# Altium project Control_Logic.PrjPcb (part 2 of 3)

## Sheet PLEN_Control_Logic_pt3.SchDoc
size 594 x 420 mm; Author: ALTIUM GOSTBOM2.0 KEV
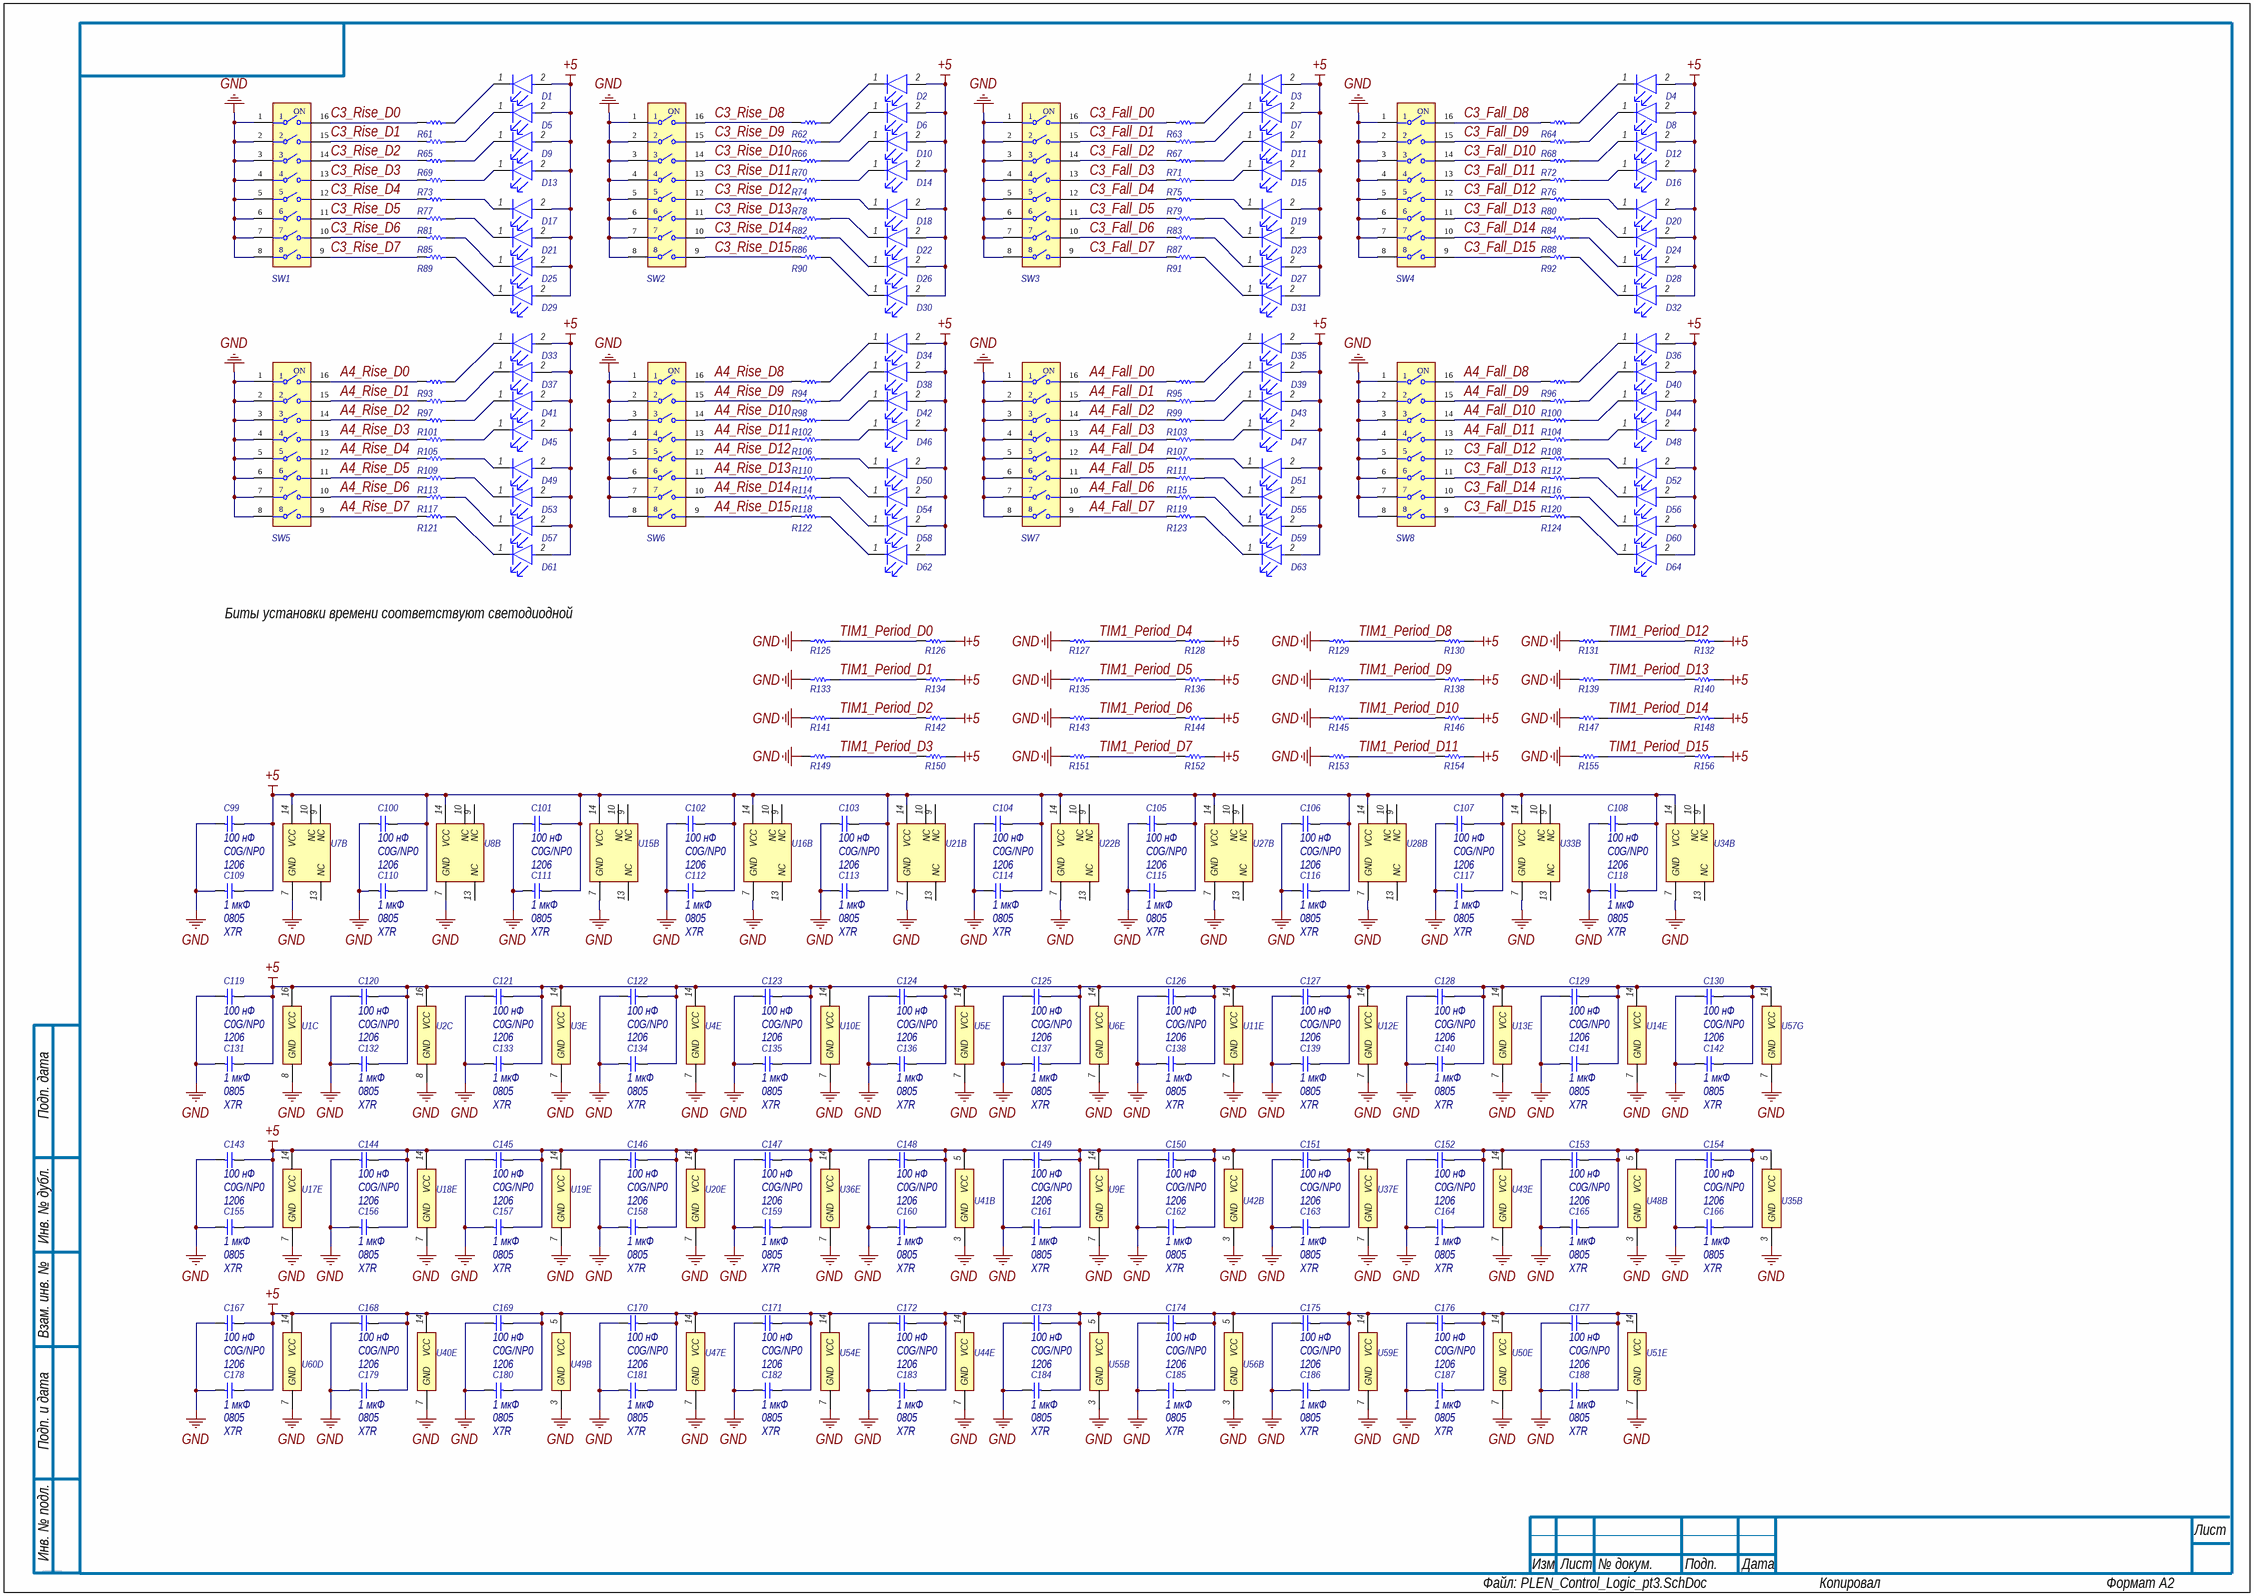
[diagram p5: PLEN_Control_Logic_pt3.SchDoc]

### Parts
(Parts that share a designator on the sheet are numbered #1, #2 ... from top to bottom, then left to right.)
C99  value 100 нФ  Dielectric Characteristic: C0G/NP0  Package Reference: 1206  [CAPC3216X180X55NL20T25]  (hidden comment: GRM31C5C1E104JA01L)
C100  value 100 нФ  Dielectric Characteristic: C0G/NP0  Package Reference: 1206  [CAPC3216X180X55NL20T25]  (hidden comment: GRM31C5C1E104JA01L)
C101#1  value 100 нФ  Dielectric Characteristic: C0G/NP0  Package Reference: 1206  [CAPC3216X180X55NL20T25]  (hidden comment: GRM31C5C1E104JA01L)
C102  value 100 нФ  Dielectric Characteristic: C0G/NP0  Package Reference: 1206  [CAPC3216X180X55NL20T25]  (hidden comment: GRM31C5C1E104JA01L)
C103  value 100 нФ  Dielectric Characteristic: C0G/NP0  Package Reference: 1206  [CAPC3216X180X55NL20T25]  (hidden comment: GRM31C5C1E104JA01L)
C104  value 100 нФ  Dielectric Characteristic: C0G/NP0  Package Reference: 1206  [CAPC3216X180X55NL20T25]  (hidden comment: GRM31C5C1E104JA01L)
C105  value 100 нФ  Dielectric Characteristic: C0G/NP0  Package Reference: 1206  [CAPC3216X180X55NL20T25]  (hidden comment: GRM31C5C1E104JA01L)
C106  value 100 нФ  Dielectric Characteristic: C0G/NP0  Package Reference: 1206  [CAPC3216X180X55NL20T25]  (hidden comment: GRM31C5C1E104JA01L)
C107  value 100 нФ  Dielectric Characteristic: C0G/NP0  Package Reference: 1206  [CAPC3216X180X55NL20T25]  (hidden comment: GRM31C5C1E104JA01L)
C108  value 100 нФ  Dielectric Characteristic: C0G/NP0  Package Reference: 1206  [CAPC3216X180X55NL20T25]  (hidden comment: GRM31C5C1E104JA01L)
C109  value 1 мкФ  Case: 0805  Dielectric: X7R  [CAPC2013X140X50LL20T25]  (hidden comment: C0805C105K3RACTU)
C110  value 1 мкФ  Case: 0805  Dielectric: X7R  [CAPC2013X140X50LL20T25]  (hidden comment: C0805C105K3RACTU)
C111#1  value 1 мкФ  Case: 0805  Dielectric: X7R  [CAPC2013X140X50LL20T25]  (hidden comment: C0805C105K3RACTU)
C112  value 1 мкФ  Case: 0805  Dielectric: X7R  [CAPC2013X140X50LL20T25]  (hidden comment: C0805C105K3RACTU)
C113  value 1 мкФ  Case: 0805  Dielectric: X7R  [CAPC2013X140X50LL20T25]  (hidden comment: C0805C105K3RACTU)
C114  value 1 мкФ  Case: 0805  Dielectric: X7R  [CAPC2013X140X50LL20T25]  (hidden comment: C0805C105K3RACTU)
C115  value 1 мкФ  Case: 0805  Dielectric: X7R  [CAPC2013X140X50LL20T25]  (hidden comment: C0805C105K3RACTU)
C116  value 1 мкФ  Case: 0805  Dielectric: X7R  [CAPC2013X140X50LL20T25]  (hidden comment: C0805C105K3RACTU)
C117  value 1 мкФ  Case: 0805  Dielectric: X7R  [CAPC2013X140X50LL20T25]  (hidden comment: C0805C105K3RACTU)
C118  value 1 мкФ  Case: 0805  Dielectric: X7R  [CAPC2013X140X50LL20T25]  (hidden comment: C0805C105K3RACTU)
C119  value 100 нФ  Dielectric Characteristic: C0G/NP0  Package Reference: 1206  [CAPC3216X180X55NL20T25]  (hidden comment: GRM31C5C1E104JA01L)
C120  value 100 нФ  Dielectric Characteristic: C0G/NP0  Package Reference: 1206  [CAPC3216X180X55NL20T25]  (hidden comment: GRM31C5C1E104JA01L)
C121  value 100 нФ  Dielectric Characteristic: C0G/NP0  Package Reference: 1206  [CAPC3216X180X55NL20T25]  (hidden comment: GRM31C5C1E104JA01L)
C122  value 100 нФ  Dielectric Characteristic: C0G/NP0  Package Reference: 1206  [CAPC3216X180X55NL20T25]  (hidden comment: GRM31C5C1E104JA01L)
C123  value 100 нФ  Dielectric Characteristic: C0G/NP0  Package Reference: 1206  [CAPC3216X180X55NL20T25]  (hidden comment: GRM31C5C1E104JA01L)
C124  value 100 нФ  Dielectric Characteristic: C0G/NP0  Package Reference: 1206  [CAPC3216X180X55NL20T25]  (hidden comment: GRM31C5C1E104JA01L)
C125  value 100 нФ  Dielectric Characteristic: C0G/NP0  Package Reference: 1206  [CAPC3216X180X55NL20T25]  (hidden comment: GRM31C5C1E104JA01L)
C126  value 100 нФ  Dielectric Characteristic: C0G/NP0  Package Reference: 1206  [CAPC3216X180X55NL20T25]  (hidden comment: GRM31C5C1E104JA01L)
C127  value 100 нФ  Dielectric Characteristic: C0G/NP0  Package Reference: 1206  [CAPC3216X180X55NL20T25]  (hidden comment: GRM31C5C1E104JA01L)
C128  value 100 нФ  Dielectric Characteristic: C0G/NP0  Package Reference: 1206  [CAPC3216X180X55NL20T25]  (hidden comment: GRM31C5C1E104JA01L)
C129  value 100 нФ  Dielectric Characteristic: C0G/NP0  Package Reference: 1206  [CAPC3216X180X55NL20T25]  (hidden comment: GRM31C5C1E104JA01L)
C130  value 100 нФ  Dielectric Characteristic: C0G/NP0  Package Reference: 1206  [CAPC3216X180X55NL20T25]  (hidden comment: GRM31C5C1E104JA01L)
C131  value 1 мкФ  Case: 0805  Dielectric: X7R  [CAPC2013X140X50LL20T25]  (hidden comment: C0805C105K3RACTU)
C132  value 1 мкФ  Case: 0805  Dielectric: X7R  [CAPC2013X140X50LL20T25]  (hidden comment: C0805C105K3RACTU)
C133  value 1 мкФ  Case: 0805  Dielectric: X7R  [CAPC2013X140X50LL20T25]  (hidden comment: C0805C105K3RACTU)
C134  value 1 мкФ  Case: 0805  Dielectric: X7R  [CAPC2013X140X50LL20T25]  (hidden comment: C0805C105K3RACTU)
C135  value 1 мкФ  Case: 0805  Dielectric: X7R  [CAPC2013X140X50LL20T25]  (hidden comment: C0805C105K3RACTU)
C136  value 1 мкФ  Case: 0805  Dielectric: X7R  [CAPC2013X140X50LL20T25]  (hidden comment: C0805C105K3RACTU)
C137  value 1 мкФ  Case: 0805  Dielectric: X7R  [CAPC2013X140X50LL20T25]  (hidden comment: C0805C105K3RACTU)
C138  value 1 мкФ  Case: 0805  Dielectric: X7R  [CAPC2013X140X50LL20T25]  (hidden comment: C0805C105K3RACTU)
C139  value 1 мкФ  Case: 0805  Dielectric: X7R  [CAPC2013X140X50LL20T25]  (hidden comment: C0805C105K3RACTU)
C140  value 1 мкФ  Case: 0805  Dielectric: X7R  [CAPC2013X140X50LL20T25]  (hidden comment: C0805C105K3RACTU)
C141  value 1 мкФ  Case: 0805  Dielectric: X7R  [CAPC2013X140X50LL20T25]  (hidden comment: C0805C105K3RACTU)
C142  value 1 мкФ  Case: 0805  Dielectric: X7R  [CAPC2013X140X50LL20T25]  (hidden comment: C0805C105K3RACTU)
C143  value 100 нФ  Dielectric Characteristic: C0G/NP0  Package Reference: 1206  [CAPC3216X180X55NL20T25]  (hidden comment: GRM31C5C1E104JA01L)
C144  value 100 нФ  Dielectric Characteristic: C0G/NP0  Package Reference: 1206  [CAPC3216X180X55NL20T25]  (hidden comment: GRM31C5C1E104JA01L)
C145  value 100 нФ  Dielectric Characteristic: C0G/NP0  Package Reference: 1206  [CAPC3216X180X55NL20T25]  (hidden comment: GRM31C5C1E104JA01L)
C146  value 100 нФ  Dielectric Characteristic: C0G/NP0  Package Reference: 1206  [CAPC3216X180X55NL20T25]  (hidden comment: GRM31C5C1E104JA01L)
C147  value 100 нФ  Dielectric Characteristic: C0G/NP0  Package Reference: 1206  [CAPC3216X180X55NL20T25]  (hidden comment: GRM31C5C1E104JA01L)
C148  value 100 нФ  Dielectric Characteristic: C0G/NP0  Package Reference: 1206  [CAPC3216X180X55NL20T25]  (hidden comment: GRM31C5C1E104JA01L)
C149  value 100 нФ  Dielectric Characteristic: C0G/NP0  Package Reference: 1206  [CAPC3216X180X55NL20T25]  (hidden comment: GRM31C5C1E104JA01L)
C150  value 100 нФ  Dielectric Characteristic: C0G/NP0  Package Reference: 1206  [CAPC3216X180X55NL20T25]  (hidden comment: GRM31C5C1E104JA01L)
C151  value 100 нФ  Dielectric Characteristic: C0G/NP0  Package Reference: 1206  [CAPC3216X180X55NL20T25]  (hidden comment: GRM31C5C1E104JA01L)
C152  value 100 нФ  Dielectric Characteristic: C0G/NP0  Package Reference: 1206  [CAPC3216X180X55NL20T25]  (hidden comment: GRM31C5C1E104JA01L)
C153  value 100 нФ  Dielectric Characteristic: C0G/NP0  Package Reference: 1206  [CAPC3216X180X55NL20T25]  (hidden comment: GRM31C5C1E104JA01L)
C154  value 100 нФ  Dielectric Characteristic: C0G/NP0  Package Reference: 1206  [CAPC3216X180X55NL20T25]  (hidden comment: GRM31C5C1E104JA01L)
C155  value 1 мкФ  Case: 0805  Dielectric: X7R  [CAPC2013X140X50LL20T25]  (hidden comment: C0805C105K3RACTU)
C156  value 1 мкФ  Case: 0805  Dielectric: X7R  [CAPC2013X140X50LL20T25]  (hidden comment: C0805C105K3RACTU)
C157  value 1 мкФ  Case: 0805  Dielectric: X7R  [CAPC2013X140X50LL20T25]  (hidden comment: C0805C105K3RACTU)
C158  value 1 мкФ  Case: 0805  Dielectric: X7R  [CAPC2013X140X50LL20T25]  (hidden comment: C0805C105K3RACTU)
C159  value 1 мкФ  Case: 0805  Dielectric: X7R  [CAPC2013X140X50LL20T25]  (hidden comment: C0805C105K3RACTU)
C160  value 1 мкФ  Case: 0805  Dielectric: X7R  [CAPC2013X140X50LL20T25]  (hidden comment: C0805C105K3RACTU)
C161  value 1 мкФ  Case: 0805  Dielectric: X7R  [CAPC2013X140X50LL20T25]  (hidden comment: C0805C105K3RACTU)
C162  value 1 мкФ  Case: 0805  Dielectric: X7R  [CAPC2013X140X50LL20T25]  (hidden comment: C0805C105K3RACTU)
C163  value 1 мкФ  Case: 0805  Dielectric: X7R  [CAPC2013X140X50LL20T25]  (hidden comment: C0805C105K3RACTU)
C164  value 1 мкФ  Case: 0805  Dielectric: X7R  [CAPC2013X140X50LL20T25]  (hidden comment: C0805C105K3RACTU)
C165  value 1 мкФ  Case: 0805  Dielectric: X7R  [CAPC2013X140X50LL20T25]  (hidden comment: C0805C105K3RACTU)
C166  value 1 мкФ  Case: 0805  Dielectric: X7R  [CAPC2013X140X50LL20T25]  (hidden comment: C0805C105K3RACTU)
C167  value 100 нФ  Dielectric Characteristic: C0G/NP0  Package Reference: 1206  [CAPC3216X180X55NL20T25]  (hidden comment: GRM31C5C1E104JA01L)
C168  value 100 нФ  Dielectric Characteristic: C0G/NP0  Package Reference: 1206  [CAPC3216X180X55NL20T25]  (hidden comment: GRM31C5C1E104JA01L)
C169  value 100 нФ  Dielectric Characteristic: C0G/NP0  Package Reference: 1206  [CAPC3216X180X55NL20T25]  (hidden comment: GRM31C5C1E104JA01L)
C170  value 100 нФ  Dielectric Characteristic: C0G/NP0  Package Reference: 1206  [CAPC3216X180X55NL20T25]  (hidden comment: GRM31C5C1E104JA01L)
C171  value 100 нФ  Dielectric Characteristic: C0G/NP0  Package Reference: 1206  [CAPC3216X180X55NL20T25]  (hidden comment: GRM31C5C1E104JA01L)
C172  value 100 нФ  Dielectric Characteristic: C0G/NP0  Package Reference: 1206  [CAPC3216X180X55NL20T25]  (hidden comment: GRM31C5C1E104JA01L)
C173  value 100 нФ  Dielectric Characteristic: C0G/NP0  Package Reference: 1206  [CAPC3216X180X55NL20T25]  (hidden comment: GRM31C5C1E104JA01L)
C174  value 100 нФ  Dielectric Characteristic: C0G/NP0  Package Reference: 1206  [CAPC3216X180X55NL20T25]  (hidden comment: GRM31C5C1E104JA01L)
C175  value 100 нФ  Dielectric Characteristic: C0G/NP0  Package Reference: 1206  [CAPC3216X180X55NL20T25]  (hidden comment: GRM31C5C1E104JA01L)
C176  value 100 нФ  Dielectric Characteristic: C0G/NP0  Package Reference: 1206  [CAPC3216X180X55NL20T25]  (hidden comment: GRM31C5C1E104JA01L)
C177  value 100 нФ  Dielectric Characteristic: C0G/NP0  Package Reference: 1206  [CAPC3216X180X55NL20T25]  (hidden comment: GRM31C5C1E104JA01L)
C178  value 1 мкФ  Case: 0805  Dielectric: X7R  [CAPC2013X140X50LL20T25]  (hidden comment: C0805C105K3RACTU)
C179  value 1 мкФ  Case: 0805  Dielectric: X7R  [CAPC2013X140X50LL20T25]  (hidden comment: C0805C105K3RACTU)
C180  value 1 мкФ  Case: 0805  Dielectric: X7R  [CAPC2013X140X50LL20T25]  (hidden comment: C0805C105K3RACTU)
C181  value 1 мкФ  Case: 0805  Dielectric: X7R  [CAPC2013X140X50LL20T25]  (hidden comment: C0805C105K3RACTU)
C182  value 1 мкФ  Case: 0805  Dielectric: X7R  [CAPC2013X140X50LL20T25]  (hidden comment: C0805C105K3RACTU)
C183  value 1 мкФ  Case: 0805  Dielectric: X7R  [CAPC2013X140X50LL20T25]  (hidden comment: C0805C105K3RACTU)
C184  value 1 мкФ  Case: 0805  Dielectric: X7R  [CAPC2013X140X50LL20T25]  (hidden comment: C0805C105K3RACTU)
C185  value 1 мкФ  Case: 0805  Dielectric: X7R  [CAPC2013X140X50LL20T25]  (hidden comment: C0805C105K3RACTU)
C186  value 1 мкФ  Case: 0805  Dielectric: X7R  [CAPC2013X140X50LL20T25]  (hidden comment: C0805C105K3RACTU)
C187  value 1 мкФ  Case: 0805  Dielectric: X7R  [CAPC2013X140X50LL20T25]  (hidden comment: C0805C105K3RACTU)
C188  value 1 мкФ  Case: 0805  Dielectric: X7R  [CAPC2013X140X50LL20T25]  (hidden comment: C0805C105K3RACTU)
D1  APTD3216CGCK  [FP-APTD3216CGCK-MFG]  (value not drawn)
D2  APTD3216CGCK  [FP-APTD3216CGCK-MFG]  (value not drawn)
D3  APTD3216CGCK  [FP-APTD3216CGCK-MFG]  (value not drawn)
D4  APTD3216CGCK  [FP-APTD3216CGCK-MFG]  (value not drawn)
D5  APTD3216CGCK  [FP-APTD3216CGCK-MFG]  (value not drawn)
D6  APTD3216CGCK  [FP-APTD3216CGCK-MFG]  (value not drawn)
D7  APTD3216CGCK  [FP-APTD3216CGCK-MFG]  (value not drawn)
D8  APTD3216CGCK  [FP-APTD3216CGCK-MFG]  (value not drawn)
D9  APTD3216CGCK  [FP-APTD3216CGCK-MFG]  (value not drawn)
D10  APTD3216CGCK  [FP-APTD3216CGCK-MFG]  (value not drawn)
D11  APTD3216CGCK  [FP-APTD3216CGCK-MFG]  (value not drawn)
D12  APTD3216CGCK  [FP-APTD3216CGCK-MFG]  (value not drawn)
D13  APTD3216CGCK  [FP-APTD3216CGCK-MFG]  (value not drawn)
D14  APTD3216CGCK  [FP-APTD3216CGCK-MFG]  (value not drawn)
D15  APTD3216CGCK  [FP-APTD3216CGCK-MFG]  (value not drawn)
D16  APTD3216CGCK  [FP-APTD3216CGCK-MFG]  (value not drawn)
D17  APTD3216CGCK  [FP-APTD3216CGCK-MFG]  (value not drawn)
D18  APTD3216CGCK  [FP-APTD3216CGCK-MFG]  (value not drawn)
D19  APTD3216CGCK  [FP-APTD3216CGCK-MFG]  (value not drawn)
D20  APTD3216CGCK  [FP-APTD3216CGCK-MFG]  (value not drawn)
D21  APTD3216CGCK  [FP-APTD3216CGCK-MFG]  (value not drawn)
D22  APTD3216CGCK  [FP-APTD3216CGCK-MFG]  (value not drawn)
D23  APTD3216CGCK  [FP-APTD3216CGCK-MFG]  (value not drawn)
D24  APTD3216CGCK  [FP-APTD3216CGCK-MFG]  (value not drawn)
D25  APTD3216CGCK  [FP-APTD3216CGCK-MFG]  (value not drawn)
D26  APTD3216CGCK  [FP-APTD3216CGCK-MFG]  (value not drawn)
D27  APTD3216CGCK  [FP-APTD3216CGCK-MFG]  (value not drawn)
D28  APTD3216CGCK  [FP-APTD3216CGCK-MFG]  (value not drawn)
D29  APTD3216CGCK  [FP-APTD3216CGCK-MFG]  (value not drawn)
D30  APTD3216CGCK  [FP-APTD3216CGCK-MFG]  (value not drawn)
D31  APTD3216CGCK  [FP-APTD3216CGCK-MFG]  (value not drawn)
D32  APTD3216CGCK  [FP-APTD3216CGCK-MFG]  (value not drawn)
D33  APTD3216CGCK  [FP-APTD3216CGCK-MFG]  (value not drawn)
D34  APTD3216CGCK  [FP-APTD3216CGCK-MFG]  (value not drawn)
D35  APTD3216CGCK  [FP-APTD3216CGCK-MFG]  (value not drawn)
D36  APTD3216CGCK  [FP-APTD3216CGCK-MFG]  (value not drawn)
D37  APTD3216CGCK  [FP-APTD3216CGCK-MFG]  (value not drawn)
D38  APTD3216CGCK  [FP-APTD3216CGCK-MFG]  (value not drawn)
D39  APTD3216CGCK  [FP-APTD3216CGCK-MFG]  (value not drawn)
D40  APTD3216CGCK  [FP-APTD3216CGCK-MFG]  (value not drawn)
D41  APTD3216CGCK  [FP-APTD3216CGCK-MFG]  (value not drawn)
D42  APTD3216CGCK  [FP-APTD3216CGCK-MFG]  (value not drawn)
D43  APTD3216CGCK  [FP-APTD3216CGCK-MFG]  (value not drawn)
D44  APTD3216CGCK  [FP-APTD3216CGCK-MFG]  (value not drawn)
D45  APTD3216CGCK  [FP-APTD3216CGCK-MFG]  (value not drawn)
D46  APTD3216CGCK  [FP-APTD3216CGCK-MFG]  (value not drawn)
D47  APTD3216CGCK  [FP-APTD3216CGCK-MFG]  (value not drawn)
D48  APTD3216CGCK  [FP-APTD3216CGCK-MFG]  (value not drawn)
D49  APTD3216CGCK  [FP-APTD3216CGCK-MFG]  (value not drawn)
D50  APTD3216CGCK  [FP-APTD3216CGCK-MFG]  (value not drawn)
D51  APTD3216CGCK  [FP-APTD3216CGCK-MFG]  (value not drawn)
D52  APTD3216CGCK  [FP-APTD3216CGCK-MFG]  (value not drawn)
D53  APTD3216CGCK  [FP-APTD3216CGCK-MFG]  (value not drawn)
D54  APTD3216CGCK  [FP-APTD3216CGCK-MFG]  (value not drawn)
D55  APTD3216CGCK  [FP-APTD3216CGCK-MFG]  (value not drawn)
D56  APTD3216CGCK  [FP-APTD3216CGCK-MFG]  (value not drawn)
D57  APTD3216CGCK  [FP-APTD3216CGCK-MFG]  (value not drawn)
D58  APTD3216CGCK  [FP-APTD3216CGCK-MFG]  (value not drawn)
D59  APTD3216CGCK  [FP-APTD3216CGCK-MFG]  (value not drawn)
D60  APTD3216CGCK  [FP-APTD3216CGCK-MFG]  (value not drawn)
D61  APTD3216CGCK  [FP-APTD3216CGCK-MFG]  (value not drawn)
D62  APTD3216CGCK  [FP-APTD3216CGCK-MFG]  (value not drawn)
D63  APTD3216CGCK  [FP-APTD3216CGCK-MFG]  (value not drawn)
D64  APTD3216CGCK  [FP-APTD3216CGCK-MFG]  (value not drawn)
R61  ERA6AEB101V  [RESC2013X60X40ML20T25]  (value not drawn)
R62  ERA6AEB101V  [RESC2013X60X40ML20T25]  (value not drawn)
R63  ERA6AEB101V  [RESC2013X60X40ML20T25]  (value not drawn)
R64  ERA6AEB101V  [RESC2013X60X40ML20T25]  (value not drawn)
R65  ERA6AEB101V  [RESC2013X60X40ML20T25]  (value not drawn)
R66  ERA6AEB101V  [RESC2013X60X40ML20T25]  (value not drawn)
R67  ERA6AEB101V  [RESC2013X60X40ML20T25]  (value not drawn)
R68  ERA6AEB101V  [RESC2013X60X40ML20T25]  (value not drawn)
R69  ERA6AEB101V  [RESC2013X60X40ML20T25]  (value not drawn)
R70  ERA6AEB101V  [RESC2013X60X40ML20T25]  (value not drawn)
R71  ERA6AEB101V  [RESC2013X60X40ML20T25]  (value not drawn)
R72  ERA6AEB101V  [RESC2013X60X40ML20T25]  (value not drawn)
R73  ERA6AEB101V  [RESC2013X60X40ML20T25]  (value not drawn)
R74  ERA6AEB101V  [RESC2013X60X40ML20T25]  (value not drawn)
R75  ERA6AEB101V  [RESC2013X60X40ML20T25]  (value not drawn)
R76  ERA6AEB101V  [RESC2013X60X40ML20T25]  (value not drawn)
R77  ERA6AEB101V  [RESC2013X60X40ML20T25]  (value not drawn)
R78  ERA6AEB101V  [RESC2013X60X40ML20T25]  (value not drawn)
R79  ERA6AEB101V  [RESC2013X60X40ML20T25]  (value not drawn)
R80  ERA6AEB101V  [RESC2013X60X40ML20T25]  (value not drawn)
R81  ERA6AEB101V  [RESC2013X60X40ML20T25]  (value not drawn)
R82  ERA6AEB101V  [RESC2013X60X40ML20T25]  (value not drawn)
R83  ERA6AEB101V  [RESC2013X60X40ML20T25]  (value not drawn)
R84  ERA6AEB101V  [RESC2013X60X40ML20T25]  (value not drawn)
R85  ERA6AEB101V  [RESC2013X60X40ML20T25]  (value not drawn)
R86  ERA6AEB101V  [RESC2013X60X40ML20T25]  (value not drawn)
R87  ERA6AEB101V  [RESC2013X60X40ML20T25]  (value not drawn)
R88  ERA6AEB101V  [RESC2013X60X40ML20T25]  (value not drawn)
R89  ERA6AEB101V  [RESC2013X60X40ML20T25]  (value not drawn)
R90  ERA6AEB101V  [RESC2013X60X40ML20T25]  (value not drawn)
R91  ERA6AEB101V  [RESC2013X60X40ML20T25]  (value not drawn)
R92  ERA6AEB101V  [RESC2013X60X40ML20T25]  (value not drawn)
R93  ERA6AEB101V  [RESC2013X60X40ML20T25]  (value not drawn)
R94  ERA6AEB101V  [RESC2013X60X40ML20T25]  (value not drawn)
R95  ERA6AEB101V  [RESC2013X60X40ML20T25]  (value not drawn)
R96  ERA6AEB101V  [RESC2013X60X40ML20T25]  (value not drawn)
R97  ERA6AEB101V  [RESC2013X60X40ML20T25]  (value not drawn)
R98  ERA6AEB101V  [RESC2013X60X40ML20T25]  (value not drawn)
R99  ERA6AEB101V  [RESC2013X60X40ML20T25]  (value not drawn)
R100  ERA6AEB101V  [RESC2013X60X40ML20T25]  (value not drawn)
R101  ERA6AEB101V  [RESC2013X60X40ML20T25]  (value not drawn)
R102  ERA6AEB101V  [RESC2013X60X40ML20T25]  (value not drawn)
R103  ERA6AEB101V  [RESC2013X60X40ML20T25]  (value not drawn)
R104  ERA6AEB101V  [RESC2013X60X40ML20T25]  (value not drawn)
R105  ERA6AEB101V  [RESC2013X60X40ML20T25]  (value not drawn)
R106  ERA6AEB101V  [RESC2013X60X40ML20T25]  (value not drawn)
R107  ERA6AEB101V  [RESC2013X60X40ML20T25]  (value not drawn)
R108  ERA6AEB101V  [RESC2013X60X40ML20T25]  (value not drawn)
R109  ERA6AEB101V  [RESC2013X60X40ML20T25]  (value not drawn)
R110  ERA6AEB101V  [RESC2013X60X40ML20T25]  (value not drawn)
R111  ERA6AEB101V  [RESC2013X60X40ML20T25]  (value not drawn)
R112  ERA6AEB101V  [RESC2013X60X40ML20T25]  (value not drawn)
R113  ERA6AEB101V  [RESC2013X60X40ML20T25]  (value not drawn)
R114  ERA6AEB101V  [RESC2013X60X40ML20T25]  (value not drawn)
R115  ERA6AEB101V  [RESC2013X60X40ML20T25]  (value not drawn)
R116  ERA6AEB101V  [RESC2013X60X40ML20T25]  (value not drawn)
R117  ERA6AEB101V  [RESC2013X60X40ML20T25]  (value not drawn)
R118  ERA6AEB101V  [RESC2013X60X40ML20T25]  (value not drawn)
R119  ERA6AEB101V  [RESC2013X60X40ML20T25]  (value not drawn)
R120  ERA6AEB101V  [RESC2013X60X40ML20T25]  (value not drawn)
R121  ERA6AEB101V  [RESC2013X60X40ML20T25]  (value not drawn)
R122  ERA6AEB101V  [RESC2013X60X40ML20T25]  (value not drawn)
R123  ERA6AEB101V  [RESC2013X60X40ML20T25]  (value not drawn)
R124  ERA6AEB101V  [RESC2013X60X40ML20T25]  (value not drawn)
R125  ERA6AEB101V  [RESC2013X60X40ML20T25]  (value not drawn)
R126  ERA6AEB101V  [RESC2013X60X40ML20T25]  (value not drawn)
R127  ERA6AEB101V  [RESC2013X60X40ML20T25]  (value not drawn)
R128  ERA6AEB101V  [RESC2013X60X40ML20T25]  (value not drawn)
R129  ERA6AEB101V  [RESC2013X60X40ML20T25]  (value not drawn)
R130  ERA6AEB101V  [RESC2013X60X40ML20T25]  (value not drawn)
R131  ERA6AEB101V  [RESC2013X60X40ML20T25]  (value not drawn)
R132  ERA6AEB101V  [RESC2013X60X40ML20T25]  (value not drawn)
R133  ERA6AEB101V  [RESC2013X60X40ML20T25]  (value not drawn)
R134  ERA6AEB101V  [RESC2013X60X40ML20T25]  (value not drawn)
R135  ERA6AEB101V  [RESC2013X60X40ML20T25]  (value not drawn)
R136  ERA6AEB101V  [RESC2013X60X40ML20T25]  (value not drawn)
R137  ERA6AEB101V  [RESC2013X60X40ML20T25]  (value not drawn)
R138  ERA6AEB101V  [RESC2013X60X40ML20T25]  (value not drawn)
R139  ERA6AEB101V  [RESC2013X60X40ML20T25]  (value not drawn)
R140  ERA6AEB101V  [RESC2013X60X40ML20T25]  (value not drawn)
R141  ERA6AEB101V  [RESC2013X60X40ML20T25]  (value not drawn)
R142  ERA6AEB101V  [RESC2013X60X40ML20T25]  (value not drawn)
R143  ERA6AEB101V  [RESC2013X60X40ML20T25]  (value not drawn)
R144  ERA6AEB101V  [RESC2013X60X40ML20T25]  (value not drawn)
R145  ERA6AEB101V  [RESC2013X60X40ML20T25]  (value not drawn)
R146  ERA6AEB101V  [RESC2013X60X40ML20T25]  (value not drawn)
R147  ERA6AEB101V  [RESC2013X60X40ML20T25]  (value not drawn)
R148  ERA6AEB101V  [RESC2013X60X40ML20T25]  (value not drawn)
R149  ERA6AEB101V  [RESC2013X60X40ML20T25]  (value not drawn)
R150  ERA6AEB101V  [RESC2013X60X40ML20T25]  (value not drawn)
R151  ERA6AEB101V  [RESC2013X60X40ML20T25]  (value not drawn)
R152  ERA6AEB101V  [RESC2013X60X40ML20T25]  (value not drawn)
R153  ERA6AEB101V  [RESC2013X60X40ML20T25]  (value not drawn)
R154  ERA6AEB101V  [RESC2013X60X40ML20T25]  (value not drawn)
R155  ERA6AEB101V  [RESC2013X60X40ML20T25]  (value not drawn)
R156  ERA6AEB101V  [RESC2013X60X40ML20T25]  (value not drawn)
SW1  78B08ST  [FP-78B08ST-MFG]  (value not drawn)
SW2  78B08ST  [FP-78B08ST-MFG]  (value not drawn)
SW3  78B08ST  [FP-78B08ST-MFG]  (value not drawn)
SW4  78B08ST  [FP-78B08ST-MFG]  (value not drawn)
SW5  78B08ST  [FP-78B08ST-MFG]  (value not drawn)
SW6  78B08ST  [FP-78B08ST-MFG]  (value not drawn)
SW7  78B08ST  [FP-78B08ST-MFG]  (value not drawn)
SW8  78B08ST  [FP-78B08ST-MFG]  (value not drawn)
U1  CD74HC4520M  [D0016A_N]  (value not drawn)  (part C of 3)
U2  CD74HC4520M  [D0016A_N]  (value not drawn)  (part C of 3)
U3  SN74HC86D  [D0014A_N]  (value not drawn)  (part E of 5)
U4  SN74HC86D  [D0014A_N]  (value not drawn)  (part E of 5)
U5  SN74HC86D  [D0014A_N]  (value not drawn)  (part E of 5)
U6  SN74HC86D  [D0014A_N]  (value not drawn)  (part E of 5)
U7  CD74HC30M96  [D0014A_N]  (value not drawn)  (part B of 2)
U8  CD74HC30M96  [D0014A_N]  (value not drawn)  (part B of 2)
U9  SN74HC32DR  [D0014A_N]  (value not drawn)  (part E of 5)
U10  SN74HC00DT  [D0014A_N]  (value not drawn)  (part E of 5)
U11  SN74HC86D  [D0014A_N]  (value not drawn)  (part E of 5)
U12  SN74HC86D  [D0014A_N]  (value not drawn)  (part E of 5)
U13  SN74HC86D  [D0014A_N]  (value not drawn)  (part E of 5)
U14  SN74HC86D  [D0014A_N]  (value not drawn)  (part E of 5)
U15  CD74HC30M96  [D0014A_N]  (value not drawn)  (part B of 2)
U16  CD74HC30M96  [D0014A_N]  (value not drawn)  (part B of 2)
U17  SN74HC86D  [D0014A_N]  (value not drawn)  (part E of 5)
U18  SN74HC86D  [D0014A_N]  (value not drawn)  (part E of 5)
U19  SN74HC86D  [D0014A_N]  (value not drawn)  (part E of 5)
U20  SN74HC86D  [D0014A_N]  (value not drawn)  (part E of 5)
U21  CD74HC30M96  [D0014A_N]  (value not drawn)  (part B of 2)
U22  CD74HC30M96  [D0014A_N]  (value not drawn)  (part B of 2)
U27  CD74HC30M96  [D0014A_N]  (value not drawn)  (part B of 2)
U28  CD74HC30M96  [D0014A_N]  (value not drawn)  (part B of 2)
U33  CD74HC30M96  [D0014A_N]  (value not drawn)  (part B of 2)
U34  CD74HC30M96  [D0014A_N]  (value not drawn)  (part B of 2)
U35  SN74AHCT1G32DBVR  [DBV0005A_N]  (value not drawn)  (part B of 2)
U36  SN74HC125DRG4  [D0014A_N]  (value not drawn)  (part E of 5)
U37  SN74HC125DRG4  [D0014A_N]  (value not drawn)  (part E of 5)
U40  SN74HC00DT  [D0014A_N]  (value not drawn)  (part E of 5)
U41  SN74AHC1G86DBVR  [DBV0005A_N]  (value not drawn)  (part B of 2)
U42  SN74AHC1G86DBVR  [DBV0005A_N]  (value not drawn)  (part B of 2)
U43  SN74HC125DRG4  [D0014A_N]  (value not drawn)  (part E of 5)
U44  SN74HC125DRG4  [D0014A_N]  (value not drawn)  (part E of 5)
U47  SN74HC00DT  [D0014A_N]  (value not drawn)  (part E of 5)
U48  SN74AHC1G86DBVR  [DBV0005A_N]  (value not drawn)  (part B of 2)
U49  SN74AHC1G86DBVR  [DBV0005A_N]  (value not drawn)  (part B of 2)
U50  SN74HC125DRG4  [D0014A_N]  (value not drawn)  (part E of 5)
U51  SN74HC125DRG4  [D0014A_N]  (value not drawn)  (part E of 5)
U54  SN74HC00DT  [D0014A_N]  (value not drawn)  (part E of 5)
U55  SN74AHC1G86DBVR  [DBV0005A_N]  (value not drawn)  (part B of 2)
U56  SN74AHC1G86DBVR  [DBV0005A_N]  (value not drawn)  (part B of 2)
U57  SN74HC14DRG4  [D0014A_N]  (value not drawn)  (part G of 7)
U59  SN74HC00DT  [D0014A_N]  (value not drawn)  (part E of 5)
U60  CD74HC11M  [D0014A_N]  (value not drawn)  (part D of 4)

### Nets
+5: C99.1 C100.1 C101#1.1 C102.1 C103.1 C104.1 C105.1 C106.1 C107.1 C108.1 C109.2 C110.2 C111#1.2 C112.2 C113.2 C114.2 C115.2 C116.2 C117.2 C118.2 C119.1 C120.1 C121.1 C122.1 C123.1 C124.1 C125.1 C126.1 C127.1 C128.1 C129.1 C130.1 C131.2 C132.2 C133.2 C134.2 C135.2 C136.2 C137.2 C138.2 C139.2 C140.2 C141.2 C142.2 C143.1 C144.1 C145.1 C146.1 C147.1 C148.1 C149.1 C150.1 C151.1 C152.1 C153.1 C154.1 C155.2 C156.2 C157.2 C158.2 C159.2 C160.2 C161.2 C162.2 C163.2 C164.2 C165.2 C166.2 C167.1 C168.1 C169.1 C170.1 C171.1 C172.1 C173.1 C174.1 C175.1 C176.1 C177.1 C178.2 C179.2 C180.2 C181.2 C182.2 C183.2 C184.2 C185.2 C186.2 C187.2 C188.2 D1.2(A) D2.2(A) D3.2(A) D4.2(A) D5.2(A) D6.2(A) D7.2(A) D8.2(A) D9.2(A) D10.2(A) D11.2(A) D12.2(A) D13.2(A) D14.2(A) D15.2(A) D16.2(A) D17.2(A) D18.2(A) D19.2(A) D20.2(A) D21.2(A) D22.2(A) D23.2(A) D24.2(A) D25.2(A) D26.2(A) D27.2(A) D28.2(A) D29.2(A) D30.2(A) D31.2(A) D32.2(A) D33.2(A) D34.2(A) D35.2(A) D36.2(A) D37.2(A) D38.2(A) D39.2(A) D40.2(A) D41.2(A) D42.2(A) D43.2(A) D44.2(A) D45.2(A) D46.2(A) D47.2(A) D48.2(A) D49.2(A) D50.2(A) D51.2(A) D52.2(A) D53.2(A) D54.2(A) D55.2(A) D56.2(A) D57.2(A) D58.2(A) D59.2(A) D60.2(A) D61.2(A) D62.2(A) D63.2(A) D64.2(A) R126.1 R128.1 R130.1 R132.1 R134.1 R136.1 R138.1 R140.1 R142.1 R144.1 R146.1 R148.1 R150.1 R152.1 R154.1 R156.1 U1.16(VCC) U2.16(VCC) U3.14(VCC) U4.14(VCC) U5.14(VCC) U6.14(VCC) U7.14(VCC) U8.14(VCC) U9.14(VCC) U10.14(VCC) U11.14(VCC) U12.14(VCC) U13.14(VCC) U14.14(VCC) U15.14(VCC) U16.14(VCC) U17.14(VCC) U18.14(VCC) U19.14(VCC) U20.14(VCC) U21.14(VCC) U22.14(VCC) U27.14(VCC) U28.14(VCC) U33.14(VCC) U34.14(VCC) U35.5(VCC) U36.14(VCC) U37.14(VCC) U40.14(VCC) U41.5(VCC) U42.5(VCC) U43.14(VCC) U44.14(VCC) U47.14(VCC) U48.5(VCC) U49.5(VCC) U50.14(VCC) U51.14(VCC) U54.14(VCC) U55.5(VCC) U56.5(VCC) U57.14(VCC) U59.14(VCC) U60.14(VCC)
GND: C99.2 C100.2 C101#1.2 C102.2 C103.2 C104.2 C105.2 C106.2 C107.2 C108.2 C109.1 C110.1 C111#1.1 C112.1 C113.1 C114.1 C115.1 C116.1 C117.1 C118.1 C119.2 C120.2 C121.2 C122.2 C123.2 C124.2 C125.2 C126.2 C127.2 C128.2 C129.2 C130.2 C131.1 C132.1 C133.1 C134.1 C135.1 C136.1 C137.1 C138.1 C139.1 C140.1 C141.1 C142.1 C143.2 C144.2 C145.2 C146.2 C147.2 C148.2 C149.2 C150.2 C151.2 C152.2 C153.2 C154.2 C155.1 C156.1 C157.1 C158.1 C159.1 C160.1 C161.1 C162.1 C163.1 C164.1 C165.1 C166.1 C167.2 C168.2 C169.2 C170.2 C171.2 C172.2 C173.2 C174.2 C175.2 C176.2 C177.2 C178.1 C179.1 C180.1 C181.1 C182.1 C183.1 C184.1 C185.1 C186.1 C187.1 C188.1 R125.2 R127.2 R129.2 R131.2 R133.2 R135.2 R137.2 R139.2 R141.2 R143.2 R145.2 R147.2 R149.2 R151.2 R153.2 R155.2 SW1.1 SW1.2 SW1.3 SW1.4 SW1.5 SW1.6 SW1.7 SW1.8 SW2.1 SW2.2 SW2.3 SW2.4 SW2.5 SW2.6 SW2.7 SW2.8 SW3.1 SW3.2 SW3.3 SW3.4 SW3.5 SW3.6 SW3.7 SW3.8 SW4.1 SW4.2 SW4.3 SW4.4 SW4.5 SW4.6 SW4.7 SW4.8 SW5.1 SW5.2 SW5.3 SW5.4 SW5.5 SW5.6 SW5.7 SW5.8 SW6.1 SW6.2 SW6.3 SW6.4 SW6.5 SW6.6 SW6.7 SW6.8 SW7.1 SW7.2 SW7.3 SW7.4 SW7.5 SW7.6 SW7.7 SW7.8 SW8.1 SW8.2 SW8.3 SW8.4 SW8.5 SW8.6 SW8.7 SW8.8 U1.8(GND) U2.8(GND) U3.7(GND) U4.7(GND) U5.7(GND) U6.7(GND) U7.7(GND) U8.7(GND) U9.7(GND) U10.7(GND) U11.7(GND) U12.7(GND) U13.7(GND) U14.7(GND) U15.7(GND) U16.7(GND) U17.7(GND) U18.7(GND) U19.7(GND) U20.7(GND) U21.7(GND) U22.7(GND) U27.7(GND) U28.7(GND) U33.7(GND) U34.7(GND) U35.3(GND) U36.7(GND) U37.7(GND) U40.7(GND) U41.3(GND) U42.3(GND) U43.7(GND) U44.7(GND) U47.7(GND) U48.3(GND) U49.3(GND) U50.7(GND) U51.7(GND) U54.7(GND) U55.3(GND) U56.3(GND) U57.7(GND) U59.7(GND) U60.7(GND)
A4_Rise_D0: R93.2 SW5.16
A4_Rise_D1: R97.2 SW5.15
A4_Rise_D2: R101.2 SW5.14
A4_Rise_D3: R105.2 SW5.13
A4_Rise_D4: R109.2 SW5.12
A4_Rise_D5: R113.2 SW5.11
A4_Rise_D6: R117.2 SW5.10
A4_Rise_D7: R121.2 SW5.9
A4_Rise_D8: R94.2 SW6.16
A4_Rise_D9: R98.2 SW6.15
A4_Rise_D10: R102.2 SW6.14
A4_Rise_D11: R106.2 SW6.13
A4_Rise_D12: R110.2 SW6.12
A4_Rise_D13: R114.2 SW6.11
A4_Rise_D14: R118.2 SW6.10
A4_Rise_D15: R122.2 SW6.9
C3_Rise_D0: R61.2 SW1.16
C3_Rise_D1: R65.2 SW1.15
C3_Rise_D2: R69.2 SW1.14
C3_Rise_D3: R73.2 SW1.13
C3_Rise_D4: R77.2 SW1.12
C3_Rise_D5: R81.2 SW1.11
C3_Rise_D6: R85.2 SW1.10
C3_Rise_D7: R89.2 SW1.9
C3_Rise_D8: R62.2 SW2.16
C3_Rise_D9: R66.2 SW2.15
C3_Rise_D10: R70.2 SW2.14
C3_Rise_D11: R74.2 SW2.13
C3_Rise_D12: R78.2 SW2.12
C3_Rise_D13: R82.2 SW2.11
C3_Rise_D14: R86.2 SW2.10
C3_Rise_D15: R90.2 SW2.9
TIM1_Period_D0: R125.1 R126.2
TIM1_Period_D1: R133.1 R134.2
TIM1_Period_D2: R141.1 R142.2
TIM1_Period_D3: R149.1 R150.2
TIM1_Period_D4: R127.1 R128.2
TIM1_Period_D5: R135.1 R136.2
TIM1_Period_D6: R143.1 R144.2
TIM1_Period_D7: R151.1 R152.2
TIM1_Period_D8: R129.1 R130.2
TIM1_Period_D9: R137.1 R138.2
TIM1_Period_D10: R145.1 R146.2
TIM1_Period_D11: R153.1 R154.2
TIM1_Period_D12: R131.1 R132.2
TIM1_Period_D13: R139.1 R140.2
TIM1_Period_D14: R147.1 R148.2
TIM1_Period_D15: R155.1 R156.2
А4_Fall_D0: R95.2 SW7.16
А4_Fall_D1: R99.2 SW7.15
А4_Fall_D2: R103.2 SW7.14
А4_Fall_D3: R107.2 SW7.13
А4_Fall_D4: R111.2 SW7.12
А4_Fall_D5: R115.2 SW7.11
А4_Fall_D6: R119.2 SW7.10
А4_Fall_D7: R123.2 SW7.9
А4_Fall_D8: R96.2 SW8.16
А4_Fall_D9: R100.2 SW8.15
А4_Fall_D10: R104.2 SW8.14
А4_Fall_D11: R108.2 SW8.13
С3_Fall_D0: R63.2 SW3.16
С3_Fall_D1: R67.2 SW3.15
С3_Fall_D2: R71.2 SW3.14
С3_Fall_D3: R75.2 SW3.13
С3_Fall_D4: R79.2 SW3.12
С3_Fall_D5: R83.2 SW3.11
С3_Fall_D6: R87.2 SW3.10
С3_Fall_D7: R91.2 SW3.9
С3_Fall_D8: R64.2 SW4.16
С3_Fall_D9: R68.2 SW4.15
С3_Fall_D10: R72.2 SW4.14
С3_Fall_D11: R76.2 SW4.13
С3_Fall_D12: R80.2 R112.2 SW4.12 SW8.12
С3_Fall_D13: R84.2 R116.2 SW4.11 SW8.11
С3_Fall_D14: R88.2 R120.2 SW4.10 SW8.10
С3_Fall_D15: R92.2 R124.2 SW4.9 SW8.9
NetD1_1: D1.1(C) R61.1
NetD2_1: D2.1(C) R62.1
NetD3_1: D3.1(C) R63.1
NetD4_1: D4.1(C) R64.1
NetD5_1: D5.1(C) R65.1
NetD6_1: D6.1(C) R66.1
NetD7_1: D7.1(C) R67.1
NetD8_1: D8.1(C) R68.1
NetD9_1: D9.1(C) R69.1
NetD10_1: D10.1(C) R70.1
NetD11_1: D11.1(C) R71.1
NetD12_1: D12.1(C) R72.1
NetD13_1: D13.1(C) R73.1
NetD14_1: D14.1(C) R74.1
NetD15_1: D15.1(C) R75.1
NetD16_1: D16.1(C) R76.1
NetD17_1: D17.1(C) R77.1
NetD18_1: D18.1(C) R78.1
NetD19_1: D19.1(C) R79.1
NetD20_1: D20.1(C) R80.1
NetD21_1: D21.1(C) R81.1
NetD22_1: D22.1(C) R82.1
NetD23_1: D23.1(C) R83.1
NetD24_1: D24.1(C) R84.1
NetD25_1: D25.1(C) R85.1
NetD26_1: D26.1(C) R86.1
NetD27_1: D27.1(C) R87.1
NetD28_1: D28.1(C) R88.1
NetD29_1: D29.1(C) R89.1
NetD30_1: D30.1(C) R90.1
NetD31_1: D31.1(C) R91.1
NetD32_1: D32.1(C) R92.1
NetD33_1: D33.1(C) R93.1
NetD34_1: D34.1(C) R94.1
NetD35_1: D35.1(C) R95.1
NetD36_1: D36.1(C) R96.1
NetD37_1: D37.1(C) R97.1
NetD38_1: D38.1(C) R98.1
NetD39_1: D39.1(C) R99.1
NetD40_1: D40.1(C) R100.1
NetD41_1: D41.1(C) R101.1
NetD42_1: D42.1(C) R102.1
NetD43_1: D43.1(C) R103.1
NetD44_1: D44.1(C) R104.1
NetD45_1: D45.1(C) R105.1
NetD46_1: D46.1(C) R106.1
NetD47_1: D47.1(C) R107.1
NetD48_1: D48.1(C) R108.1
NetD49_1: D49.1(C) R109.1
NetD50_1: D50.1(C) R110.1
NetD51_1: D51.1(C) R111.1
NetD52_1: D52.1(C) R112.1
NetD53_1: D53.1(C) R113.1
NetD54_1: D54.1(C) R114.1
NetD55_1: D55.1(C) R115.1
NetD56_1: D56.1(C) R116.1
NetD57_1: D57.1(C) R117.1
NetD58_1: D58.1(C) R118.1
NetD59_1: D59.1(C) R119.1
NetD60_1: D60.1(C) R120.1
NetD61_1: D61.1(C) R121.1
NetD62_1: D62.1(C) R122.1
NetD63_1: D63.1(C) R123.1
NetD64_1: D64.1(C) R124.1

Not connected (* = marked no-connect by the designer): U7 9(NC) 10(NC) 13(NC); U8 9(NC) 10(NC) 13(NC); U15 9(NC) 10(NC) 13(NC); U16 9(NC) 10(NC) 13(NC); U21 9(NC) 10(NC) 13(NC); U22 9(NC) 10(NC) 13(NC); U27 9(NC) 10(NC) 13(NC); U28 9(NC) 10(NC) 13(NC); U33 9(NC) 10(NC) 13(NC); U34 9(NC) 10(NC) 13(NC)

### Notes on the sheet
- Биты установки времени соответствуют светодиодной индикации
- Подп. дата
- Инв. № дубл.
- Взам. инв. №
- Подп. и дата
- Инв. № подл.
- Изм.
- Лист
- № докум.
- Подп.
- Дата
- ALTIUM GOSTBOM2.0 KEV
- Файл:
- Копировал
- Формат А2
- (in symbol CMP-31942-000004-2) ON

### Library data of the parts
C99 C100 C101#1 C102-C108 C119-C130 C143-C154 C167-C177 = CMP-2000-06343-1: Chip Capacitor, 100 nF, +/- 5%, 25 V, -55 to 125 degC, 1206 (3216 Metric), RoHS, Tape and Reel; Manufacturer: Murata; External Width: 0.5mm; Voltage Rating V DC: 25V; Capacitor Case Style: 1206[3216Metric]; Insulation Resistance: 10000Mohm; Capacitor Terminals: SMD; Temperature Coefficient: 0ppm/°C±30ppm/°C; External Length / Height: 1mm; Reel Quantity: 2000; SVHC: NoSVHC(19-Dec-2012); No. of Pins: 2; Manufacturer URL: http://www.murata.com/; Mounting Technology: SurfaceMount; Operating Temperature Range: -55°Cto+125°C; Operating Temperature Max: 125°C; Package Description: 2-Pin Surface Mount Device, Body 3.2 x 1.6 mm; Operating Temperature Min: -55°C; Terminal Type: SurfaceMount(SMD,SMT); MSL: –; Tolerance +: 5%; Voltage Rating: 25V; Datasheet URL: https://datasheet.ciiva.com/3777/11308grm31c5c1e104ja0123-3777177.pdf; Datasheet Version: 09/2014; Package / Case: 1206; Capacitance Tolerance: ±5%; Lead Spacing: –; Tolerance -: 5%
C109 C110 C111#1 C112-C118 C131-C142 C155-C166 C178-C188 = CMP-2007-03234-1: Manufacturer: Kemet; Part Number: C0805C105K3RACTU
D1-D64 = CMP-2000-05792-2: LED GREEN CLEAR 2SMD; Forward Voltage: 2.1V; Forward Current: 20mA; Luminous Intensity: 300mcd; Number of LEDs: 1; Dominant Wavelength: 570nm; Viewing Angle: 50°; Lead Free: Lead Free; Lens Color: Clear; Mount: Surface Mount; Package Quantity: 2000; Height: 1.8mm; Number of Pins: 2; Test Current: 20mA; Case Code (Metric): 3216; Case/Package: 1206; Case Code (Imperial): 1206; Illumination Color: Green; Color: Green; Width: 1.6mm; Packaging: Tape and Reel; Min Operating Temperature: -40°C; Lens Style: Clear; Max Operating Temperature: 85°C; Length: 3.2mm
R61-R156 = CMP-2001-00580-1: Manufacturer: Panasonic; Part Number: ERA6AEB101V
SW1-SW8 = CMP-31942-000004-2: SWITCH SLIDE DIP SPST 150MA 30V; Electrical Life: 2000Cycles; Number of Switches: 8; Pitch: 0.1inch; Lead Length: 2.54mm; Actuator Type: Slide (Standard); Washable: Yes; Actuator Length: 1.27mm; Body Material: Thermoplastic; Insulation Resistance: 5GR; Contact Current Rating: 25mA; Contact Resistance: 30mR; Number of Positions: 8; Number of Circuits: 8; Mount: Through Hole; Depth: 9.65mm; Max Operating Temperature: 85°C; Max Voltage Rating (DC): 30V; Current Rating: 150mA; Voltage Rating (DC): 30V; Throw Configuration: SPST; Series: 78; Material: Thermoplastic; REACH SVHC: No SVHC; Contact Material: Copper Alloy; Orientation: Straight; Contact Plating: Gold; Max Current Rating: 150mA; Mechanical Life: 2000Cycles; Min Operating Temperature: -40°C; Radiation Hardening: No; Termination: PC Pins; Length: 22.4mm; RoHS Compliant: Yes; Packaging: Rail/Tube; Terminal Pitch: 2.54mm; Voltage Rating: 30V; Lead Free: Lead Free
U1 U2 = CMP-1623-00119-2: High Speed CMOS Logic Dual Binary Up-Counters, D0016A, TUBE; Manufacturer: Texas Instruments; VCC(Min)(V): 2; tpd @ Nom Voltage(Max)(ns): 51; Inputs: 1; Voltage(Nom)(V): 6; Output Drive (IOL/IOH)(Max)(mA): 5.2/-5.2; Technology Family: HC; Rating: Military; ICC @ Nom Voltage(Max)(mA): 0.08; Bits(#): 4; F @ Nom Voltage(Max)(Mhz): 28; Generic Part Number: CD74HC4520; Type: Binary; PackageReference: D0016A; DatasheetVersion: SCHS216D; Operating Temperature Range(C): -55 to 125; Code_JEDEC: MS-012 variation AC; Function: Counter; VCC(Max)(V): 6
U3-U6 U11-U14 U17-U20 = CMP-0778-00002-3: Quadruple 2-Input Exclusive-OR Gates, D0014A, TUBE; Manufacturer: Texas Instruments; Input Type: CMOS; Technology Family: HC; Rating: Catalog; Schmitt Trigger: No; Bits(#): 4; tpd @ Nom Voltage(Max)(ns): 21; VCC(Max)(V): 6; Output Drive (IOL/IOH)(Max)(mA): 5.2/-5.2; VCC(Min)(V): 2; ICC @ Nom Voltage(Max)(mA): 0.02; Voltage(Nom)(V): 5; F @ Nom Voltage(Max)(Mhz): 70; PackageReference: D0014A; DatasheetVersion: SCLS100E; Generic Part Number: SN74HC86; Output Type: CMOS; Operating Temperature Range(C): -40 to 85
U7 U8 U15 U16 U21 U22 U27 U28 U33 U34 = CMP-1627-00017-2: High Speed CMOS Logic 8-Input NAND Gate, D0014A, LARGE T&R; Manufacturer: Texas Instruments; Output Drive (IOL/IOH)(Max)(mA): 4/-4; Bits(#): 1; VCC(Min)(V): 2; F @ Nom Voltage(Max)(Mhz): 70; Rating: Catalog; tpd @ Nom Voltage(Max)(ns): 28; Schmitt Trigger: No; Voltage(Nom)(V): 5; ICC @ Nom Voltage(Max)(mA): 0.02; Technology Family: HC; VCC(Max)(V): 6; DatasheetVersion: SCHS121D; Operating Temperature Range(C): -55 to 125; Output Type: CMOS; Generic Part Number: CD74HC30; Input Type: CMOS; PackageReference: D0014A; Code_JEDEC: MS-012
U9 = CMP-1573-00006-3: Quadruple 2-Input Positive-OR Gates, D0014A, LARGE T&R; Manufacturer: Texas Instruments; Bits(#): 4; VCC(Max)(V): 6; F @ Nom Voltage(Max)(Mhz): 70; ICC @ Nom Voltage(Max)(mA): 0.02; Input Type: CMOS; Voltage(Nom)(V): 5; tpd @ Nom Voltage(Max)(ns): 25; Output Drive (IOL/IOH)(Max)(mA): 5.2/-5.2; Rating: Catalog; VCC(Min)(V): 2; Generic Part Number: SN74HC32; PackageReference: D0014A; DatasheetVersion: SCLS200D; Operating Temperature Range(C): -40 to 85; Output Type: CMOS; Code_JEDEC: MS-012; PackageVersion: http://www.ti.com/lit/ml/mpds177g/mpds177g.pdf
U10 U40 U47 U54 U59 = CMP-1627-00178-2: Quad 2-Input Positive-NAND Gates, D0014A, SMALL T&R; Manufacturer: Texas Instruments; Rating: Catalog; F @ Nom Voltage(Max)(Mhz): 70; VCC(Max)(V): 6; tpd @ Nom Voltage(Max)(ns): 23; VCC(Min)(V): 2; Schmitt Trigger: Yes; Output Drive (IOL/IOH)(Max)(mA): 5.2/-5.2; Voltage(Nom)(V): 5; Technology Family: HC; Output Type: CMOS; Bits(#): 4; ICC @ Nom Voltage(Max)(mA): 0.02; Operating Temperature Range(C): -40 to 85; DatasheetVersion: SCLS181E; PackageReference: D0014A; Code_JEDEC: MS-012; Generic Part Number: SN74HC00; Input Type: CMOS
U35 = CMP-0859-00067-3: Single 2-Input Positive-OR Gate, DBV0005A, LARGE T&R; Manufacturer: Texas Instruments; Technology Family: AHCT; VCC(Min)(V): 2; Voltage(Nom)(V): 5; Schmitt Trigger: No; Gate Type: OR; Sub-Family: OR Gate; Input Type: CMOS; ICC @ Nom Voltage(Max)(mA): 0.01; VCC(Max)(V): 5.5; Bits(#): 1; F @ Nom Voltage(Max)(Mhz): 75; Output Drive (IOL/IOH)(Max)(mA): 8/-8; tpd @ Nom Voltage(Max)(ns): 8; Logic: True; Rating: Catalog; Operating Temperature Range(C): -40 to 125; Generic Part Number: SN74AHCT1G32; DatasheetVersion: SCLS320O; PackageReference: DBV0005A; 3-State Output: No; Output Type: CMOS
U36 U37 U43 U44 U50 U51 = CMP-0440-00033-3: Quadruple Bus Buffer Gates With 3-State Outputs, D0014A, LARGE T&R; Manufacturer: Texas Instruments; ICC @ Nom Voltage(Max)(mA): 0.16; F @ Nom Voltage(Max)(Mhz): 28; Rating: Catalog; Input Type: CMOS; VCC(Min)(V): 2; VCC(Max)(V): 6; Bits(#): 4; tpd @ Nom Voltage(Max)(ns): 26; Generic Part Number: SN74HC125; Output Type: CMOS; DatasheetVersion: SCLS104D; PackageReference: D0014A; PackageVersion: http://www.ti.com/lit/ml/mpds177g/mpds177g.pdf; Operating Temperature Range(C): -40 to 85; Voltage(Nom)(V): 6; Code_JEDEC: MS-012
U41 U42 U48 U49 U55 U56 = CMP-0859-00164-3: Single 2-Input Exclusive-OR Gate, DBV0005A, LARGE T&R; Manufacturer: Texas Instruments; Input Type: CMOS; Sub-Family: XOR Gate; Logic: True; F @ Nom Voltage(Max)(Mhz): 75; Schmitt Trigger: No; VCC(Min)(V): 2; Bits(#): 1; Voltage(Nom)(V): 3.3,5; Gate Type: XOR; VCC(Max)(V): 5.5; Rating: Catalog; ICC @ Nom Voltage(Max)(mA): 0.01; tpd @ Nom Voltage(Max)(ns): 14.5,8.8; Output Drive (IOL/IOH)(Max)(mA): 50/-50; Technology Family: AHC; DatasheetVersion: SCLS323N; Generic Part Number: SN74AHC1G86; Output Type: CMOS; PackageReference: DBV0005A; Operating Temperature Range(C): -40 to 125; 3-State Output: No
U57 = CMP-1615-00271-3: Hex Schmitt-Trigger Inverters, D0014A, LARGE T&R; Manufacturer: Texas Instruments; ICC @ Nom Voltage(Max)(mA): 0.02; VCC(Max)(V): 6; VCC(Min)(V): 2; Rating: Catalog; Technology Family: HC; Input Type: CMOS; Voltage(Nom)(V): 5; F @ Nom Voltage(Max)(Mhz): 20; Output Drive (IOL/IOH)(Max)(mA): -4/4; Schmitt Trigger: Yes; tpd @ Nom Voltage(Max)(ns): 31; PackageReference: D0014A; Generic Part Number: SN74HC14; Bits(#): 6; DatasheetVersion: SCLS085G; Output Type: CMOS; Code_JEDEC: MS-012; Operating Temperature Range(C): -40 to 85
U60 = CMP-0777-00088-3: High Speed CMOS Logic Triple 3-Input AND Gates, D0014A, TUBE; Manufacturer: Texas Instruments; Schmitt Trigger: No; tpd @ Nom Voltage(Max)(ns): 25; Technology Family: HC; Rating: Catalog; F @ Nom Voltage(Max)(Mhz): 70; Bits(#): 3; Output Drive (IOL/IOH)(Max)(mA): -5.2/5.2; ICC @ Nom Voltage(Max)(mA): 0.02; Voltage(Nom)(V): 5; VCC(Max)(V): 6; VCC(Min)(V): 2; Output Type: CMOS; Input Type: CMOS; Generic Part Number: CD74HC11; Operating Temperature Range(C): -55 to 125; DatasheetVersion: SCHS273E; PackageReference: D0014A

## Sheet PLEN_Control_Logic_pt4.SchDoc
size 420 x 297 mm; Author: ALTIUM GOSTBOM2.0 KEV
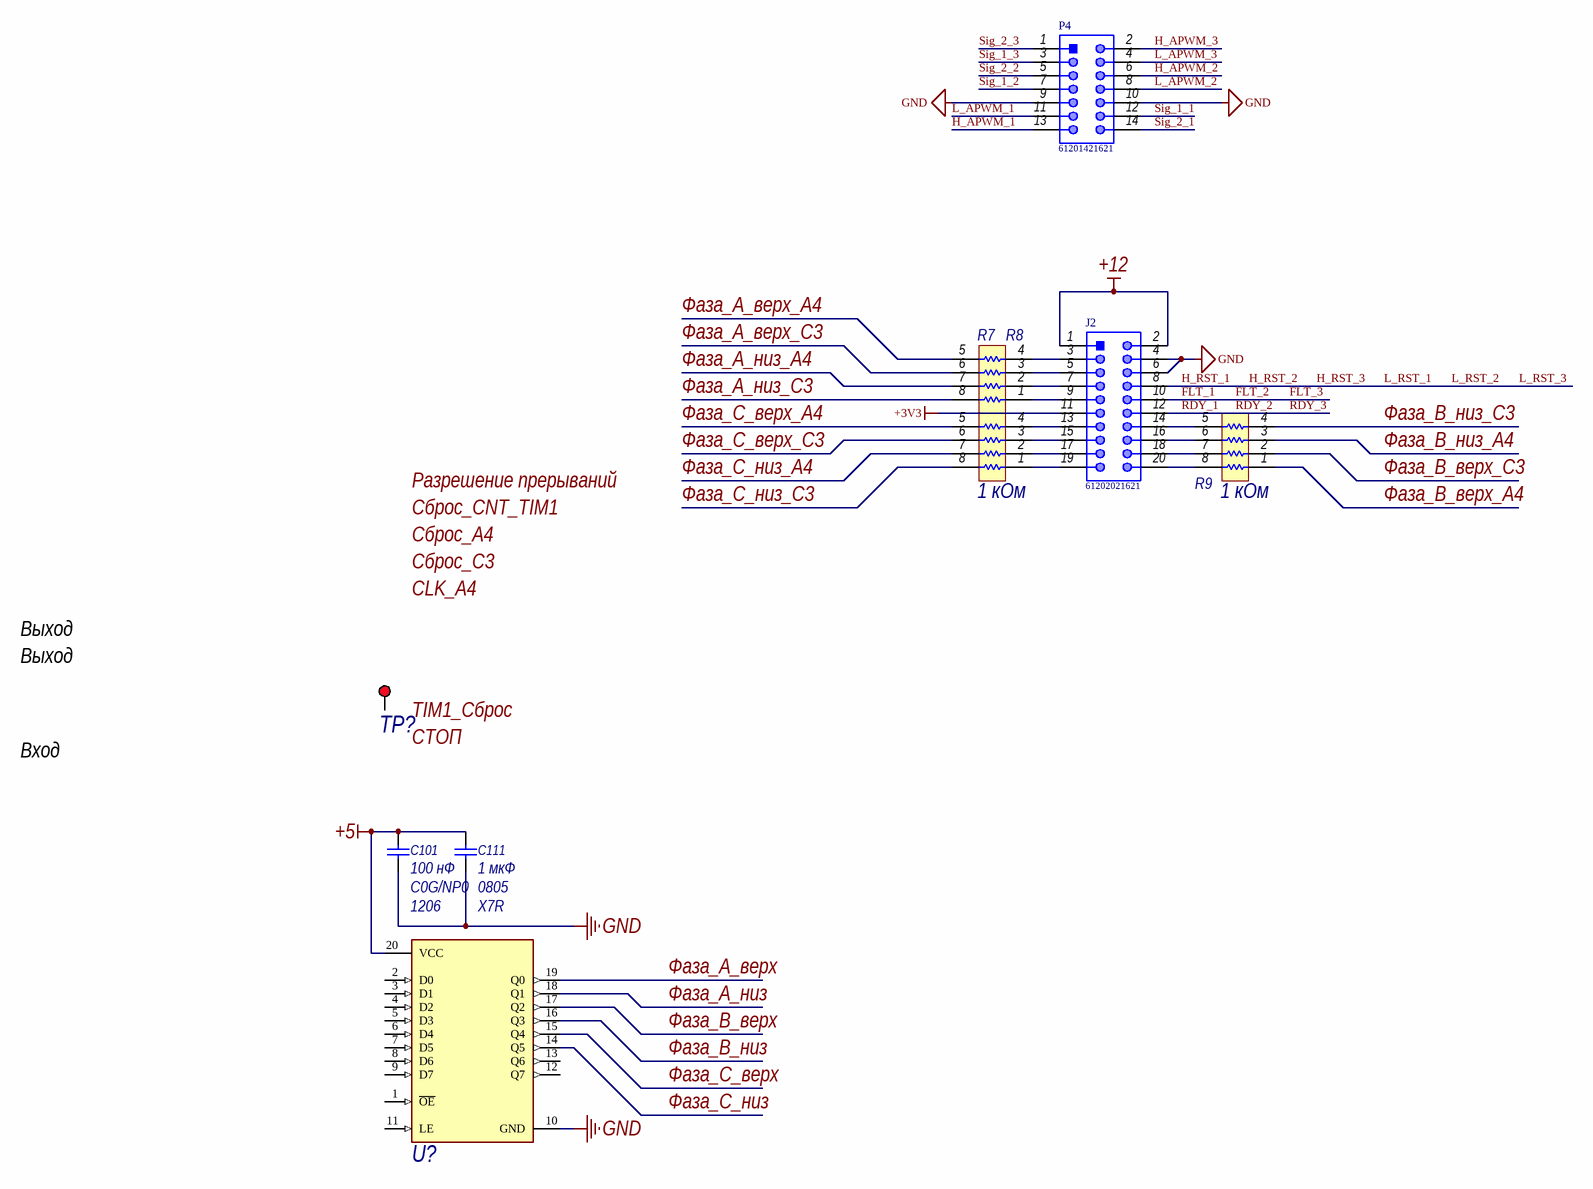
[diagram p6: PLEN_Control_Logic_pt4.SchDoc]

### Parts
(Parts that share a designator on the sheet are numbered #1, #2 ... from top to bottom, then left to right.)
C101#2  value 100 нФ  Dielectric Characteristic: C0G/NP0  Package Reference: 1206  [CAPC3216X180X55NL20T25]  (hidden comment: GRM31C5C1E104JA01L)
C111#2  value 1 мкФ  Case: 0805  Dielectric: X7R  [CAPC2013X140X50LL20T25]  (hidden comment: C0805C105K3RACTU)
J2  61202021621  [61202021621]
P4  61201421621  [61201421621]
R7#2  CAT16-103J4LF  [BOUR-CAT16-103J4LF_N]  (value not drawn)
R8#2  value 1 кОм  [BOUR-CAT16-103J4LF_N]  (hidden comment: CAT16-103J4LF)
R9#2  value 1 кОм  [BOUR-CAT16-103J4LF_N]  (hidden comment: CAT16-103J4LF)
TP?  5010  [KSTN-5010_V]  (value not drawn)
U?  74HC573D,653  [FP-SOT163-1-MFG]  (value not drawn)

### Nets
+3V3: J2.11
+5: C101#2.1 C111#2.2 U?.20(VCC)
+12: J2.1 J2.2
GND: C101#2.2 C111#2.1 J2.4 J2.6 P4.9 P4.10 U?.10(GND)
FLT_1: J2.10  [also labelled FLT_2, FLT_3]
H_APWM_1: P4.13
H_APWM_2: P4.6
H_APWM_3: P4.2
H_RST_1: J2.8  [also labelled H_RST_2, H_RST_3, L_RST_1, L_RST_2, L_RST_3]
L_APWM_1: P4.11
L_APWM_2: P4.8
L_APWM_3: P4.4
RDY_1: J2.12  [also labelled RDY_2, RDY_3]
Sig_1_1: P4.12
Sig_1_2: P4.7
Sig_1_3: P4.3
Sig_2_1: P4.14
Sig_2_2: P4.5
Sig_2_3: P4.1
Фаза_A_низ: U?.18(Q1)
Фаза_A_низ_A4: R7#2.7
Фаза_A_низ_C3: R7#2.8
Фаза_B_верх: U?.17(Q2)
Фаза_B_верх_A4: R9#2.1
Фаза_B_верх_C3: R9#2.2
Фаза_B_низ: U?.16(Q3)
Фаза_B_низ_A4: R9#2.3
Фаза_B_низ_C3: R9#2.4
Фаза_C_верх: U?.15(Q4)
Фаза_C_верх_A4: R8#2.5
Фаза_C_верх_C3: R8#2.6
Фаза_C_низ: U?.14(Q5)
Фаза_C_низ_A4: R8#2.7
Фаза_C_низ_C3: R8#2.8
Фаза_А_верх: U?.19(Q0)
Фаза_А_верх_A4: R7#2.5
Фаза_А_верх_C3: R7#2.6
NetJ2_3: J2.3 R7#2.4
NetJ2_5: J2.5 R7#2.3
NetJ2_7: J2.7 R7#2.2
NetJ2_9: J2.9 R7#2.1
NetJ2_13: J2.13 R8#2.4
NetJ2_14: J2.14 R9#2.5
NetJ2_15: J2.15 R8#2.3
NetJ2_16: J2.16 R9#2.6
NetJ2_17: J2.17 R8#2.2
NetJ2_18: J2.18 R9#2.7
NetJ2_19: J2.19 R8#2.1
NetJ2_20: J2.20 R9#2.8

Not connected (* = marked no-connect by the designer): TP? 1; U? 1(~{OE}) 2(D0) 3(D1) 4(D2) 5(D3) 6(D4) 7(D5) 8(D6) 9(D7) 11(LE) 12(Q7) 13(Q6)

### Notes on the sheet
- Выход
- Вход
- Labels drawn without touching a wire or pin: CLK_A4, TIM1_Сброс, Разрешение прерываний, Сброс_A4, Сброс_C3, Сброс_CNT_TIM1, СТОП
- Перв. примен.
- Справ. №
- Подп. дата
- Инв. № дубл.
- Взам. инв. №
- Подп. и дата
- Изм.
- Разраб.
- Лист
- № докум.
- Подп.
- Дата
- Лит.
- Масса
- Масштаб
- Пров.
- Т.контр.
- Листов
- Инв. № подл.
- Н.контр.
- Утв.
- ALTIUM GOSTBOM2.0 KEV
- Файл:
- Копировал
- Формат А3

### Library data of the parts
C101#2 = CMP-2000-06343-1: as C99 on sheet PLEN_Control_Logic_pt3; Manufacturer URL: http://www.murata.com/; Mounting Technology: SurfaceMount; Operating Temperature Range: -55°Cto+125°C; Operating Temperature Max: 125°C; Package Description: 2-Pin Surface Mount Device, Body 3.2 x 1.6 mm; Operating Temperature Min: -55°C; Terminal Type: SurfaceMount(SMD,SMT); MSL: –; Tolerance +: 5%; Voltage Rating: 25V; Datasheet URL: https://datasheet.ciiva.com/3777/11308grm31c5c1e104ja0123-3777177.pdf; Datasheet Version: 09/2014; Package / Case: 1206; Capacitance Tolerance: ±5%; Lead Spacing: –; Tolerance -: 5%
C111#2 = CMP-2007-03234-1: Manufacturer: Kemet; Part Number: C0805C105K3RACTU
J2 = CMP-1502-00010-1: Male Box Header WR-BHD, THT, Vertical, pitch 2.54 mm, 20 pins; Manufacturer: Wurth Elektronik; Contact Resistance: 20mOhm; Withstanding Voltage: 500VAC; Pitch: 2.54mm; Pin Number: 20; Working Voltage: 250VAC; Orientation: Vertical; Package Reference: 61202021621; Publisher: WurthElektronik; Datasheet URL: https://katalog.we-online.de/em/datasheet/6120xx21621.pdf; Operating Temperature: -40to125degC; Packaging: Tray; Part Number: 61202021621; Mounting Technology: THT; Gender: Male; Manufacturer URL: http://www.we-online.de; Published Date: August2018
P4 = CMP-1502-00008-1: Male Box Header WR-BHD, THT, Vertical, pitch 2.54 mm, 14 pins; Manufacturer: Wurth Elektronik; Contact Resistance: 20mOhm; Pitch: 2.54mm; Pin Number: 14; Withstanding Voltage: 500VAC; Working Voltage: 250VAC; Part Number: 61201421621; Mounting Technology: THT; Datasheet URL: https://katalog.we-online.de/em/datasheet/6120xx21621.pdf; Gender: Male; Manufacturer URL: http://www.we-online.de; Publisher: WurthElektronik; Orientation: Vertical; Operating Temperature: -40to125degC; Packaging: Tray; Published Date: August2018; Package Reference: 61201421621
R7#2 = CMP-2000-06067-1: CAT / CAY 16 Series - Chip Resistor Array, 10 KOhm, +/- 5%, 50 V, -55 to 125 degC, 8-Pin SMD, RoHS, Tape and Reel; Manufacturer: Bourns; Power Per Element: 62.5mW; Online Catalog: CAT16Series; Value: 1 кОм; Number of Resistors: 4; EDA / CAD Models: DownloadfromAcceleratedDesigns; Temperature Coefficient: ±200ppm/°C; Circuit Type: Isolated; Other Names: CAT16-103J4LFDKR; Package Reference: CAT16-103J4LF; Datasheet Version: 09/2014; Series: CAT16; Manufacturer URL: http://www.bourns.com/; Mounting Type: SurfaceMount; Datasheet URL: http://www.mouser.com/ds/2/54/ATCAY-777361.pdf; Category: Resistors; Height: 0.024"(0.60mm); Mounting Technology: SurfaceMount; Applications: -; Size / Dimension: 0.126"Lx0.061"W(3.20mmx1.55mm); Packaging: Digi-Reel®; Package / Case: 1206(3216Metric),Concave,LongSideTerminals; Supplier Device Package: 1206; RoHS Information: CAT16MaterialDeclaration; Number of Pins: 8; Family: ResistorNetworks,Arrays; Standard Package: 1; Package Description: 8-Pin Surface Mount Device, Body 3.2 x 1.55 mm, Pitch 0.8 mm; Operating Temperature: -55°C~125°C; Tolerance: ±5%
R8#2 R9#2 = CMP-2000-06067-1: CAT / CAY 16 Series - Chip Resistor Array, 10 KOhm, +/- 5%, 50 V, -55 to 125 degC, 8-Pin SMD, RoHS, Tape and Reel; Manufacturer: Bourns; Power Per Element: 62.5mW; Online Catalog: CAT16Series; Number of Resistors: 4; EDA / CAD Models: DownloadfromAcceleratedDesigns; Temperature Coefficient: ±200ppm/°C; Circuit Type: Isolated; Other Names: CAT16-103J4LFDKR; Package Reference: CAT16-103J4LF; Datasheet Version: 09/2014; Series: CAT16; Manufacturer URL: http://www.bourns.com/; Mounting Type: SurfaceMount; Datasheet URL: http://www.mouser.com/ds/2/54/ATCAY-777361.pdf; Category: Resistors; Height: 0.024"(0.60mm); Mounting Technology: SurfaceMount; Applications: -; Size / Dimension: 0.126"Lx0.061"W(3.20mmx1.55mm); Packaging: Digi-Reel®; Package / Case: 1206(3216Metric),Concave,LongSideTerminals; Supplier Device Package: 1206; RoHS Information: CAT16MaterialDeclaration; Number of Pins: 8; Family: ResistorNetworks,Arrays; Standard Package: 1; Package Description: 8-Pin Surface Mount Device, Body 3.2 x 1.55 mm, Pitch 0.8 mm; Operating Temperature: -55°C~125°C; Tolerance: ±5%
TP? = CMP-1672-00002-4: Test Point, Red, Through Hole, RoHS, Bulk; Manufacturer: Keystone; Contact Material: Bronze; Mounting Technology: Through Hole; RoHSCompliant: true; Pins: 1; Package Quantity: 100; ComponentLink2Description: Datasheet; Height: 8.12 mm; ComponentLink1URL: http://www.keyelco.com/; DatasheetVersion: Rev. F, 12/2013; Mount: Through Hole; PackageReference: 5010; Contact Plating: Silver; Packaging: Bulk; Colour: Red; REACH SVHC: No SVHC; PackageDescription: 1-Pin Through Hole Device, Dia 3.17 mm; ComponentLink2URL: http://www.keyelco.com/product-pdf.cfm?p=1319; ComponentLink1Description: Manufacturer URL
U? = CMP-14349-000004-1: IC LATCH OCTAL D 3STATE 20SOIC; RoHS Compliant: Yes